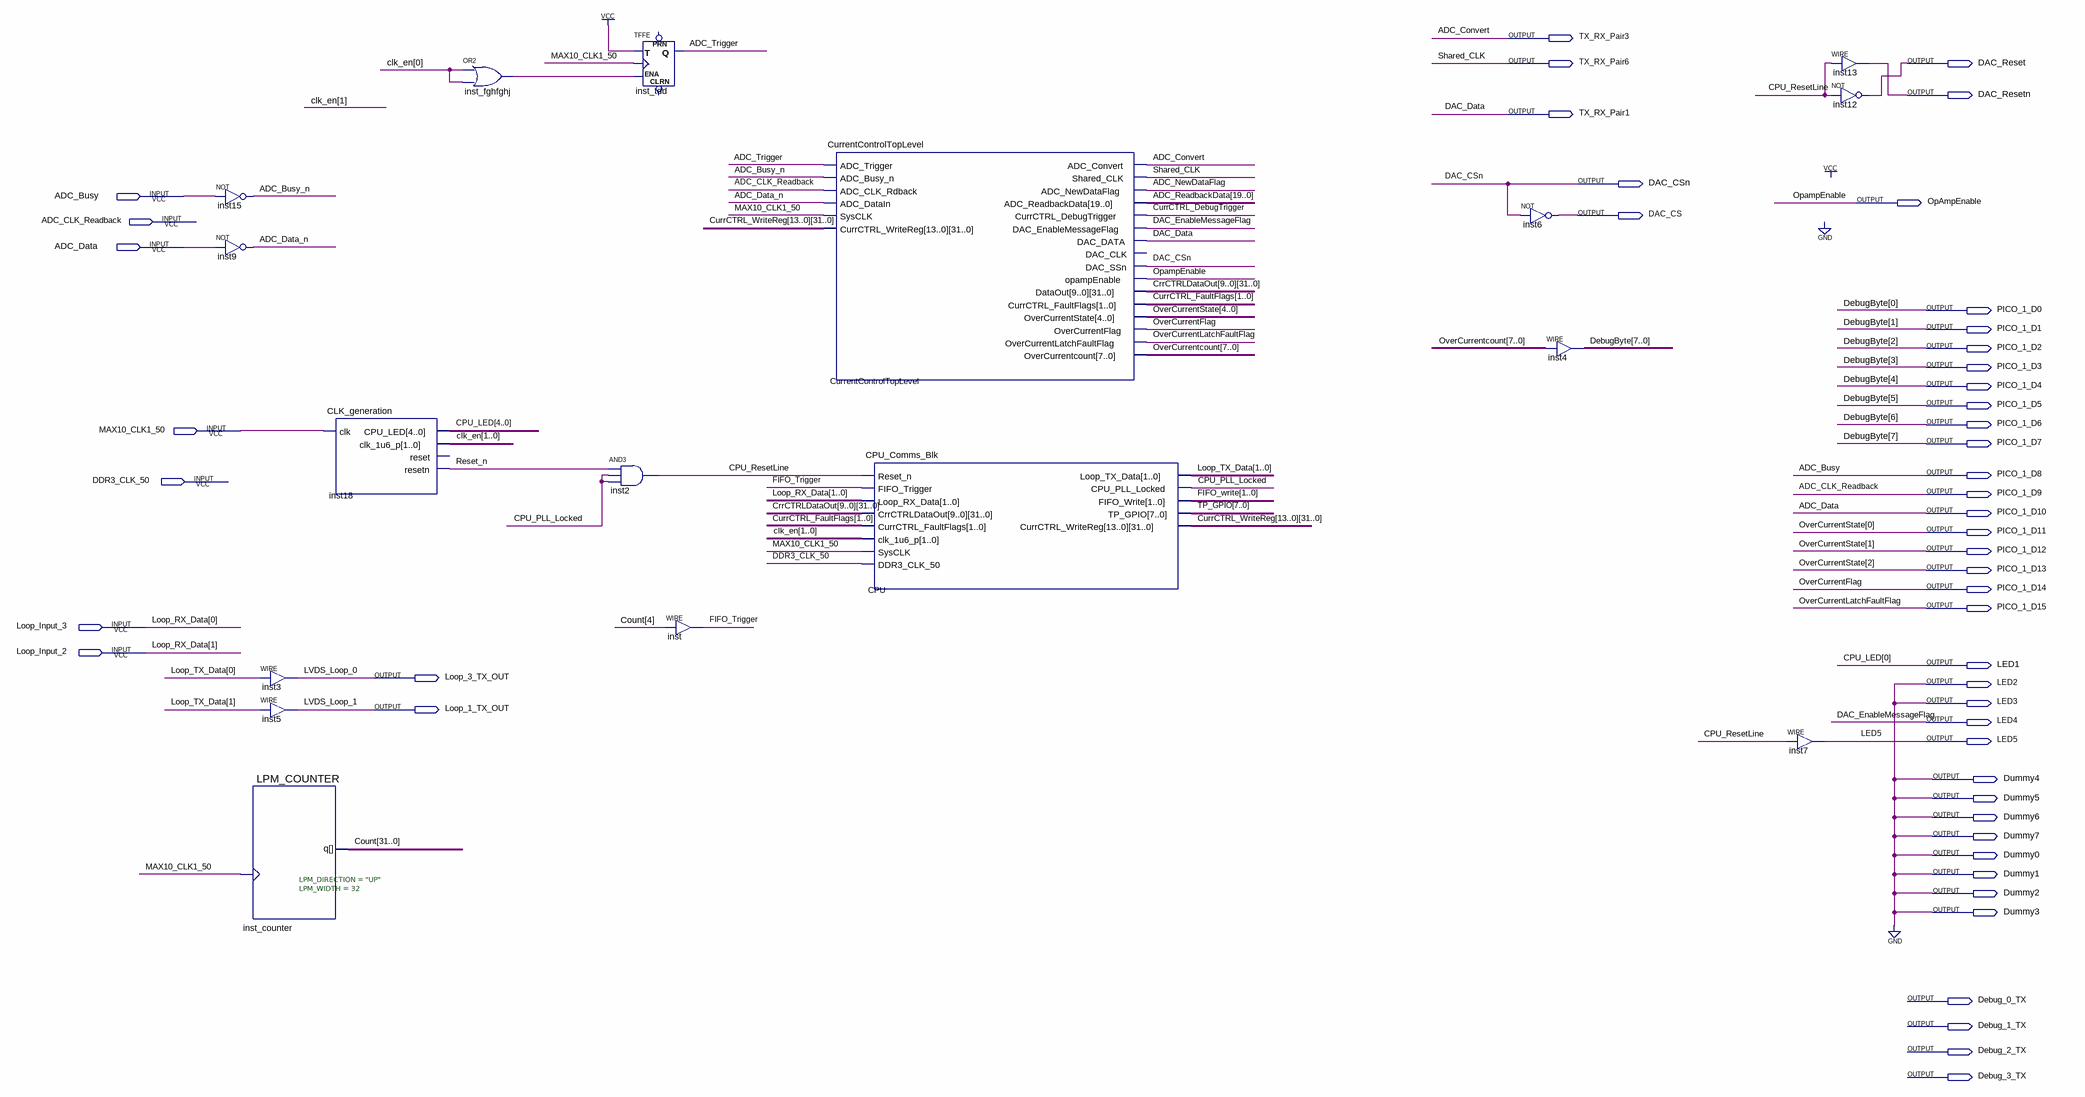
[diagram p0: schematic sheet]
// Quartus schematic Mk8_InlineController_Fncs_TopLevel_Temp.bdf as structural Verilog: 17 symbols, 50 pins
module Mk8_InlineController_Fncs_TopLevel_Temp (
  input  ADC_Busy,
  input  ADC_CLK_Readback,
  input  ADC_Data,
  input  MAX10_CLK1_50,
  input  DDR3_CLK_50,
  input  Loop_Input_3,
  input  Loop_Input_2,
  output TX_RX_Pair3,
  output TX_RX_Pair6,
  output DAC_Reset,
  output DAC_Resetn,
  output TX_RX_Pair1,
  output DAC_CSn,
  output OpAmpEnable,
  output DAC_CS,
  output PICO_1_D0,
  output PICO_1_D1,
  output PICO_1_D2,
  output PICO_1_D3,
  output PICO_1_D4,
  output PICO_1_D5,
  output PICO_1_D6,
  output PICO_1_D7,
  output PICO_1_D8,
  output PICO_1_D9,
  output PICO_1_D10,
  output PICO_1_D11,
  output PICO_1_D12,
  output PICO_1_D13,
  output PICO_1_D14,
  output PICO_1_D15,
  output LED1,
  output Loop_3_TX_OUT,
  output LED2,
  output LED3,
  output Loop_1_TX_OUT,
  output LED4,
  output LED5,
  output Dummy4,
  output Dummy5,
  output Dummy6,
  output Dummy7,
  output Dummy0,
  output Dummy1,
  output Dummy2,
  output Dummy3,
  output Debug_0_TX,
  output Debug_1_TX,
  output Debug_2_TX,
  output Debug_3_TX
);

  wire ADC_Busy_n, ADC_Data_n, ADC_NewDataFlag, ADC_Trigger, CPU_PLL_Locked, CPU_ResetLine,
       CurrCTRL_DebugTrigger, FIFO_Trigger, inst_fghfghj_out, Reset_n;
  wire [1:0] clk_en, CurrCTRL_FaultFlags, FIFO_write, Loop_TX_Data;
  wire [4:1] CPU_LED;
  wire [4:3] OverCurrentState;
  wire [7:0] OverCurrentcount, TP_GPIO;
  wire [19:0] ADC_ReadbackData;
  wire [31:0] Count, CrrCTRLDataOut_0, CrrCTRLDataOut_1, CrrCTRLDataOut_2, CrrCTRLDataOut_3,
       CrrCTRLDataOut_4, CrrCTRLDataOut_5, CrrCTRLDataOut_6, CrrCTRLDataOut_7, CrrCTRLDataOut_8,
       CrrCTRLDataOut_9, CurrCTRL_WriteReg_0, CurrCTRL_WriteReg_1, CurrCTRL_WriteReg_2, CurrCTRL_WriteReg_3,
       CurrCTRL_WriteReg_4, CurrCTRL_WriteReg_5, CurrCTRL_WriteReg_6, CurrCTRL_WriteReg_7,
       CurrCTRL_WriteReg_8, CurrCTRL_WriteReg_9, CurrCTRL_WriteReg_10, CurrCTRL_WriteReg_11,
       CurrCTRL_WriteReg_12, CurrCTRL_WriteReg_13;

  not inst15 (ADC_Busy_n, ADC_Busy);
  not inst9 (ADC_Data_n, ADC_Data);
  assign Loop_3_TX_OUT = Loop_TX_Data[0];  // WIRE inst3
  assign Loop_1_TX_OUT = Loop_TX_Data[1];  // WIRE inst5
  LPM_COUNTER #(.LPM_DIRECTION("UP"), .LPM_WIDTH(32)) inst_counter (.clock(MAX10_CLK1_50), .q(Count));
  CLK_generation inst18 (
    .clk(MAX10_CLK1_50), .CPU_LED({CPU_LED, LED1}), .clk_1u6_p(clk_en), .resetn(Reset_n));  // open: reset
  or inst_fghfghj (inst_fghfghj_out, clk_en[0], clk_en[0]);
  and inst2 (CPU_ResetLine, Reset_n, CPU_PLL_Locked, CPU_PLL_Locked);
  TFFE inst_tdd (.T(1'b1), .CLK(MAX10_CLK1_50), .ENA(inst_fghfghj_out), .Q(ADC_Trigger));  // open: CLRN, PRN
  assign FIFO_Trigger = Count[4];  // WIRE inst
  CurrentControlTopLevel CurrentControlTopLevel (
    .ADC_Trigger(ADC_Trigger), .ADC_Busy_n(ADC_Busy_n), .ADC_CLK_Rdback(ADC_CLK_Readback),
    .ADC_DataIn(ADC_Data_n), .SysCLK(MAX10_CLK1_50),
    .CurrCTRL_WriteReg({CurrCTRL_WriteReg_13, CurrCTRL_WriteReg_12, CurrCTRL_WriteReg_11, CurrCTRL_WriteReg_10, CurrCTRL_WriteReg_9, CurrCTRL_WriteReg_8, CurrCTRL_WriteReg_7, CurrCTRL_WriteReg_6, CurrCTRL_WriteReg_5, CurrCTRL_WriteReg_4, CurrCTRL_WriteReg_3, CurrCTRL_WriteReg_2, CurrCTRL_WriteReg_1, CurrCTRL_WriteReg_0}),
    .ADC_Convert(TX_RX_Pair3), .Shared_CLK(TX_RX_Pair6), .ADC_NewDataFlag(ADC_NewDataFlag),
    .ADC_ReadbackData(ADC_ReadbackData), .CurrCTRL_DebugTrigger(CurrCTRL_DebugTrigger),
    .DAC_EnableMessageFlag(LED4), .DAC_DATA(TX_RX_Pair1), .DAC_SSn(DAC_CSn), .opampEnable(OpAmpEnable),
    .DataOut({CrrCTRLDataOut_9, CrrCTRLDataOut_8, CrrCTRLDataOut_7, CrrCTRLDataOut_6, CrrCTRLDataOut_5, CrrCTRLDataOut_4, CrrCTRLDataOut_3, CrrCTRLDataOut_2, CrrCTRLDataOut_1, CrrCTRLDataOut_0}),
    .CurrCTRL_FaultFlags(CurrCTRL_FaultFlags),
    .OverCurrentState({OverCurrentState, PICO_1_D13, PICO_1_D12, PICO_1_D11}), .OverCurrentFlag(PICO_1_D14),
    .OverCurrentLatchFaultFlag(PICO_1_D15), .OverCurrentcount(OverCurrentcount));  // open: DAC_CLK
  CPU_Comms_Blk CPU (
    .Reset_n(CPU_ResetLine), .FIFO_Trigger(FIFO_Trigger), .Loop_RX_Data({Loop_Input_2, Loop_Input_3}),
    .CrrCTRLDataOut({CrrCTRLDataOut_9, CrrCTRLDataOut_8, CrrCTRLDataOut_7, CrrCTRLDataOut_6, CrrCTRLDataOut_5, CrrCTRLDataOut_4, CrrCTRLDataOut_3, CrrCTRLDataOut_2, CrrCTRLDataOut_1, CrrCTRLDataOut_0}),
    .CurrCTRL_FaultFlags(CurrCTRL_FaultFlags), .clk_1u6_p(clk_en), .SysCLK(MAX10_CLK1_50),
    .DDR3_CLK_50(DDR3_CLK_50), .Loop_TX_Data(Loop_TX_Data), .CPU_PLL_Locked(CPU_PLL_Locked),
    .FIFO_Write(FIFO_write), .TP_GPIO(TP_GPIO),
    .CurrCTRL_WriteReg({CurrCTRL_WriteReg_13, CurrCTRL_WriteReg_12, CurrCTRL_WriteReg_11, CurrCTRL_WriteReg_10, CurrCTRL_WriteReg_9, CurrCTRL_WriteReg_8, CurrCTRL_WriteReg_7, CurrCTRL_WriteReg_6, CurrCTRL_WriteReg_5, CurrCTRL_WriteReg_4, CurrCTRL_WriteReg_3, CurrCTRL_WriteReg_2, CurrCTRL_WriteReg_1, CurrCTRL_WriteReg_0}));
  not inst6 (DAC_CS, DAC_CSn);
  assign {PICO_1_D7, PICO_1_D6, PICO_1_D5, PICO_1_D4, PICO_1_D3, PICO_1_D2, PICO_1_D1, PICO_1_D0} = OverCurrentcount;  // WIRE inst4
  assign DAC_Resetn = CPU_ResetLine;  // WIRE inst13
  not inst12 (DAC_Reset, CPU_ResetLine);
  assign LED5 = CPU_ResetLine;  // WIRE inst7

  assign Dummy0 = 1'b0;
  assign Dummy1 = 1'b0;
  assign Dummy2 = 1'b0;
  assign Dummy3 = 1'b0;
  assign Dummy4 = 1'b0;
  assign Dummy5 = 1'b0;
  assign Dummy6 = 1'b0;
  assign Dummy7 = 1'b0;
  assign LED2 = 1'b0;
  assign LED3 = 1'b0;
  assign PICO_1_D8 = ADC_Busy;
  assign PICO_1_D9 = ADC_CLK_Readback;
  assign PICO_1_D10 = ADC_Data;

  // Other names for the same wires on the sheet: ADC_Convert = TX_RX_Pair3; CPU_LED[0] = LED1; DAC_Data = TX_RX_Pair1;
  //   DAC_EnableMessageFlag = LED4;
  //   DebugByte[7:0] = {PICO_1_D7, PICO_1_D6, PICO_1_D5, PICO_1_D4, PICO_1_D3, PICO_1_D2, PICO_1_D1, PICO_1_D0};
  //   Loop_RX_Data[1:0] = {Loop_Input_2, Loop_Input_3}; LVDS_Loop_0 = Loop_3_TX_OUT; LVDS_Loop_1 = Loop_1_TX_OUT;
  //   OverCurrentFlag = PICO_1_D14; OverCurrentLatchFaultFlag = PICO_1_D15;
  //   OverCurrentState[2:0] = {PICO_1_D13, PICO_1_D12, PICO_1_D11}; Shared_CLK = TX_RX_Pair6
endmodule
